# Altium schematic sheet Table of Contents.SchDoc
size A
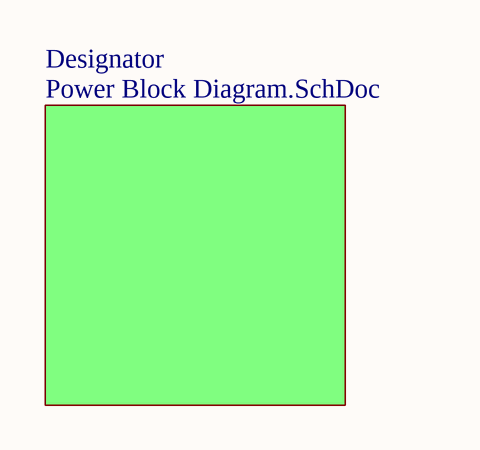
[diagram p0: Table of Contents.SchDoc]

## Sub-sheets
Designator = Power Block Diagram.SchDoc: no entries